# EAGLE schematic čítač-schéma-oprava (EAGLE 9.6.2)
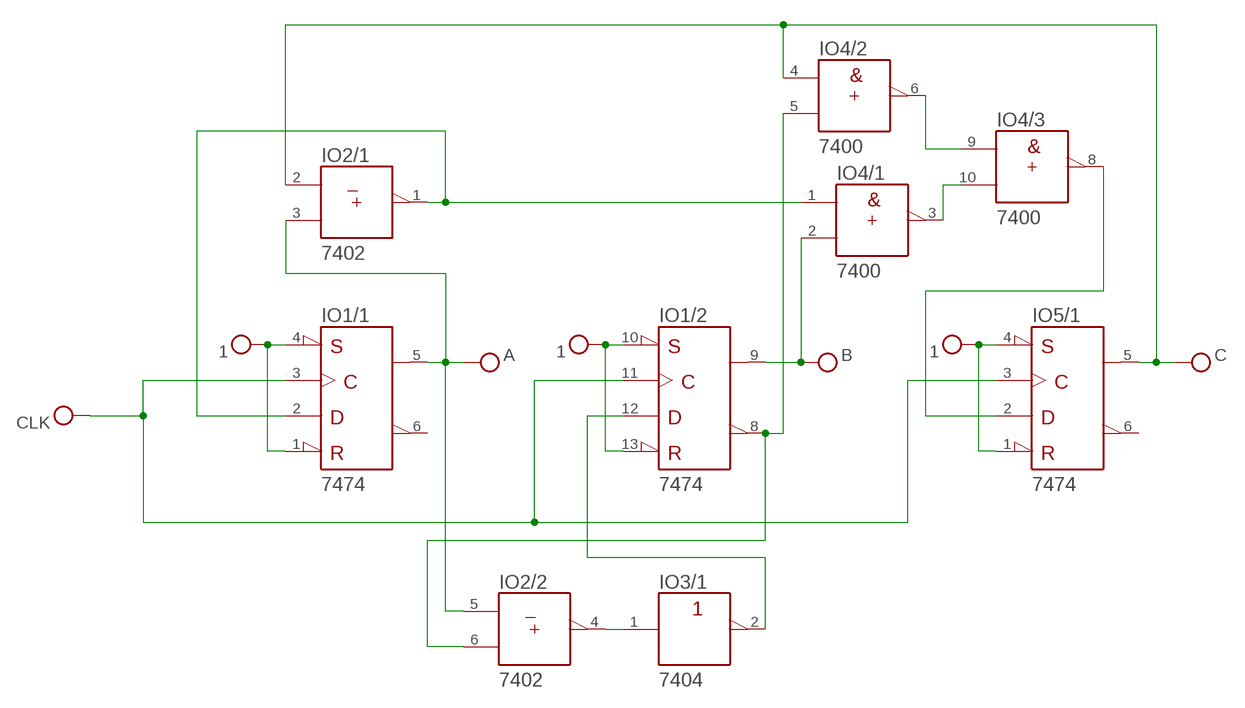
[diagram p0: schematic, sheet 1]

## Parts
IO1  7474  7474N  [DIL14]
IO2  7402  7402N  [DIL14]
IO3  7404  7404N  [DIL14]
IO4  7400  7400N  [DIL14]
IO5  7474  7474N  [DIL14]

## Nets
N$1: IO2.4(/2:Y) IO3.1(/1:A)
N$2: IO1.2(/1:D) IO2.1(/1:Y) IO4.1(/1:A)
N$3: IO4.6(/2:Y) IO4.9(/3:A)
N$4: IO1.8(/2:!Q) IO2.6(/2:B) IO4.5(/2:B)
N$5: IO1.12(/2:D) IO3.2(/1:Y)
N$6: IO4.8(/3:Y) IO5.2(/1:D)
N$7: IO4.3(/1:Y) IO4.10(/3:B)
VCC: IO1.1(/1:!CLR) IO1.3(/1:CLK) IO1.4(/1:!PRE) IO1.5(/1:Q) IO1.9(/2:Q) IO1.10(/2:!PRE) IO1.11(/2:CLK) IO1.13(/2:!CLR) IO2.2(/1:A) IO2.3(/1:B) IO2.5(/2:A) IO4.2(/1:B) IO4.4(/2:A) IO5.1(/1:!CLR) IO5.3(/1:CLK) IO5.4(/1:!PRE) IO5.5(/1:Q) ; supply symbol labelled CLK, A, B, C, 1
Unconnected: IO1.6(/1:!Q) IO2.8(/3:A) IO2.9(/3:B) IO2.10(/3:Y) IO2.11(/4:A) IO2.12(/4:B) IO2.13(/4:Y) IO3.3(/2:A) IO3.4(/2:Y) IO3.5(/3:A) IO3.6(/3:Y) IO3.8(/4:Y) IO3.9(/4:A) IO3.10(/5:Y) IO3.11(/5:A) IO3.12(/6:Y) IO3.13(/6:A) IO4.11(/4:Y) IO4.12(/4:A) IO4.13(/4:B) IO5.6(/1:!Q) IO5.8(/2:!Q) IO5.9(/2:Q) IO5.10(/2:!PRE) IO5.11(/2:CLK) IO5.12(/2:D) IO5.13(/2:!CLR)

## Power pins joined to a net without a drawn wire
+UB: IO1.14(/+UB:+UB) IO2.14(/+UB:+UB) IO3.14(/+UB:+UB) IO4.14(/+UB:+UB) IO5.14(/+UB:+UB)
-UB: IO1.7(/-UB:-UB) IO2.7(/-UB:-UB) IO3.7(/-UB:-UB) IO4.7(/-UB:-UB) IO5.7(/-UB:-UB)

## Library data of the parts
IO1 IO5 = 74ttl-din:74*74: Dual D type positive edge triggered FLIP FLOP, preset and clear
IO2 = 74ttl-din:74*02: Quad 2-input NOR gate
IO3 = 74ttl-din:74*04: Hex INVERTER
IO4 = 74ttl-din:74*00: Quad 2-input NAND gate